# EAGLE design L240-1 (EAGLE 9.5.0)
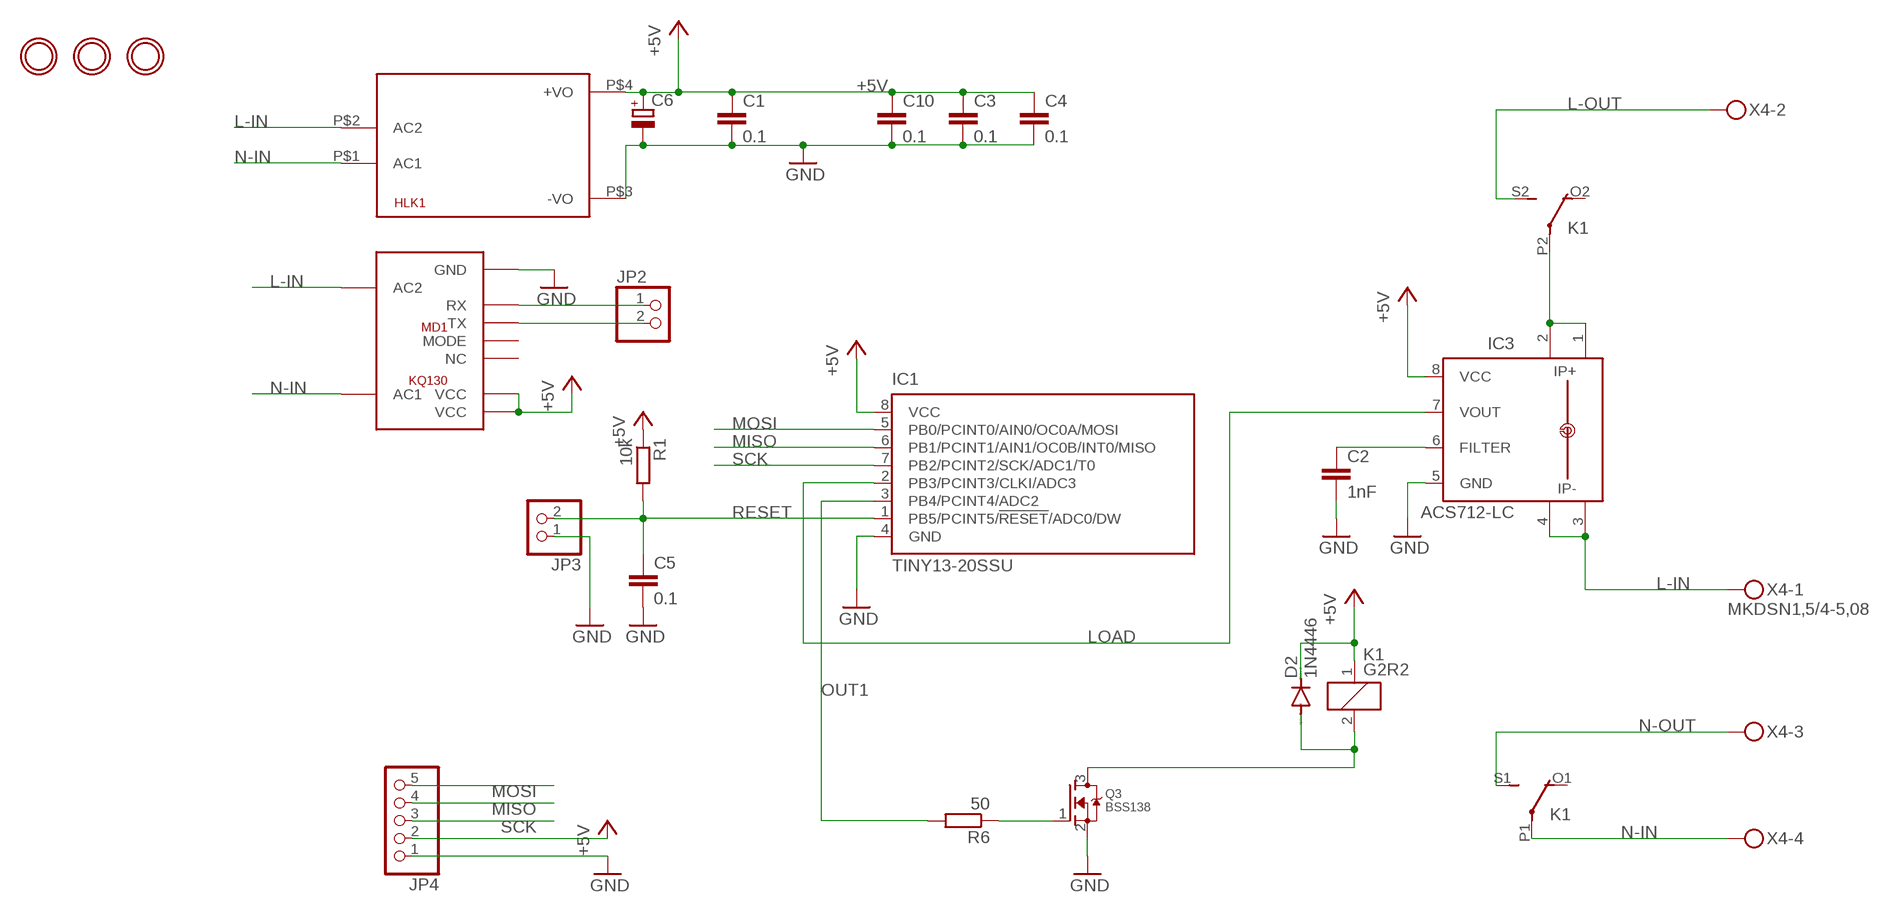
[diagram p0: schematic, sheet 1]

## Parts
C1  0.1  C-EUC0805  [C0805]
C2  1nF  C-EUC0805  [C0805]
C3  0.1  C-EUC0805  [C0805]
C4  0.1  C-EUC0805  [C0805]
C5  0.1  C-EUC0805  [C0805]
C6  CPOL-EUE5-5  [E5-5]
C10  0.1  C-EUC0805  [C0805]
D2  1N4446  [DO35-10]
HLK1  HLK-PM013W  [HLK-PM01]
IC1  TINY13-20SSU  [8S1]
IC3  ACS712-LC  [SOIC8]
JP2  PINHD-1X2  [1X02]
JP3  PINHD-1X2  [1X02]
JP4  PINHD-1X5  [1X05]
K1  G2R2  [G2R2]
MD1  KQ130  [KQ130]
Q3  BSS138  MOSFET-NWIDE  [SOT23-WIDE]
R1  10k  R-EU_R0805  [R0805]
R6  50  R-EU_R0805  [R0805]
U$1  MOUNTINGHOLE3.0THIN  [MOUNTINGHOLE_3.0_PLATEDTHIN]
U$2  MOUNTINGHOLE3.0THIN  [MOUNTINGHOLE_3.0_PLATEDTHIN]
U$3  MOUNTINGHOLE3.0THIN  [MOUNTINGHOLE_3.0_PLATEDTHIN]
X4  MKDSN1,5/4-5,08  [MKDSN1,5/4-5,08]

## Nets
+5V: C1.1 C3.1 C4.1 C6.+ C10.1 D2.C HLK1.P$4(+VO) IC1.8(VCC) IC3.8(VCC) JP4.2 K1.1 MD1.VCC@1(VCC) MD1.VCC@2(VCC) R1.1
GND: C1.2 C2.2 C3.2 C4.2 C5.2 C6.- C10.2 HLK1.P$3(-VO) IC1.4(GND) IC3.5(GND) JP3.1 JP4.1 MD1.GND Q3.2(S)
L-IN: HLK1.P$2(AC2) IC3.3(IP-) IC3.4(IP-1) MD1.AC2 X4.1
L-OUT: K1.S2(3:S) X4.2
LOAD: IC1.2(PB3/PCINT3/CLKI/ADC3) IC3.7(VOUT)
MISO: IC1.6(PB1/PCINT1/AIN1/OC0B/INT0/MISO) JP4.4
MOSI: IC1.5(PB0/PCINT0/AIN0/OC0A/MOSI) JP4.5
N$1: JP2.1 MD1.RX
N$2: IC3.1(IP+) IC3.2(IP+1) K1.P2(3:P)
N$3: JP2.2 MD1.TX
N$7: C2.1 IC3.6(FILTER)
N$11: Q3.1(G) R6.1
N$13: D2.A K1.2 Q3.3(D)
N-IN: HLK1.P$1(AC1) K1.P1(2:P) MD1.AC1 X4.4
N-OUT: K1.S1(2:S) X4.3
OUT1: IC1.3(PB4/PCINT4/ADC2) R6.2
RESET: C5.1 IC1.1(PB5/PCINT5/!RESET!/ADC0/DW) JP3.2 R1.2
SCK: IC1.7(PB2/PCINT2/SCK/ADC1/T0) JP4.3
Unconnected: K1.O1(2:O) K1.O2(3:O) MD1.MODE MD1.NC

## Library data of the parts
C1-C5 C10 = rcl:C-EU: CAPACITOR, European symbol
C6 = rcl:CPOL-EU: POLARIZED CAPACITOR, European symbol; SPICEPREFIX: C
D2 = diode:1N4446: DIODE high speed (Philips)
HLK1 = hi-link:HLK-PM01: Hi-Link Power Supply HLK-PM01 3W Author: Ahmed Said <https://github.com/AhmedSaid/EAGLELibraries>
IC1 = atmel:TINY13: 8-bit AVR Microcontroller with 1K Bytes In-System Programmable Flash Source: http://www.atmel.com/dyn/resources/prod_documents/2535S.pdf; MPN: ATTINY13-20SSU; OC_FARNELL: 1455133; OC_NEWARK: 58M3771
IC3 = allegro-2:ACS712-LC
JP2 JP3 = pinhead:PINHD-1X2: PIN HEADER
JP4 = pinhead:PINHD-1X5: PIN HEADER
K1 = relay:G2R2: RELAY 2 x switch, Omron; MF: OMRON COMPONENTS USA; MPN: G2R-2-DC6; OC_FARNELL: unknown; OC_NEWARK: 89C5317
MD1 = MyLib:KQ130
Q3 = MyLib:MOSFET-N: N-Channel Mosfet LEGEND VDS: Voltage Drain-Source ID: Drain Current RDS(ON): Drain-Source On-State Resistance VGS(TH): Gate-Source Threshold Voltage CISS: Drain-Source Input Capacitance SOT-23 Name VDS ID RDS(ON) VGS(TH) CISS Order Number 2N7002E 60V 260mA 2.5 Ohm 2.5V @ 250uA 26.7pF @ 25V 2N7002ET1GOSTR-ND BSH103 30V 850mA 400 mOhm 400mV @ 1mA 83pF @ 24V BSH103,235-ND BSS138 60V 320mA 1.6 Ohm 1.5V @ 250uA 50pF @ 10V Mouser: 771-BSS138PW115 DMN2075U-7 20V 4.2A 38 mOhm 1V @ 250 uA 594.3pF @ 10V DMN2075U-7DICT-ND IRLML6344TRPbF 30V 5.0A 37 mOhm * BSS138 good choice for I2C level-shifting
R1 R6 = rcl:R-EU_: RESISTOR, European symbol
U$1-U$3 = MyLib:MOUNTINGHOLE: Mounting Hole For #2 screws (0.086"/2.18mm width, 0.094"/2.4mm hole) use 2.5mm
X4 = con-phoenix-508:MKDSN1,5/4-5,08: MKDSN 1,5/ 4-5,08 Printklemme Nennstrom: 13,5 A Nennspannung: 250 V Rastermaß: 5,08 mm Polzahl: 4 Anschlussart: Schraubanschluss Montage: Löten Anschlussrichtung Leiter/Platine: 0 ° Artikelnummer: 1729144 Source: http://eshop.phoenixcontact.com .. 1729144.pdf

## Board
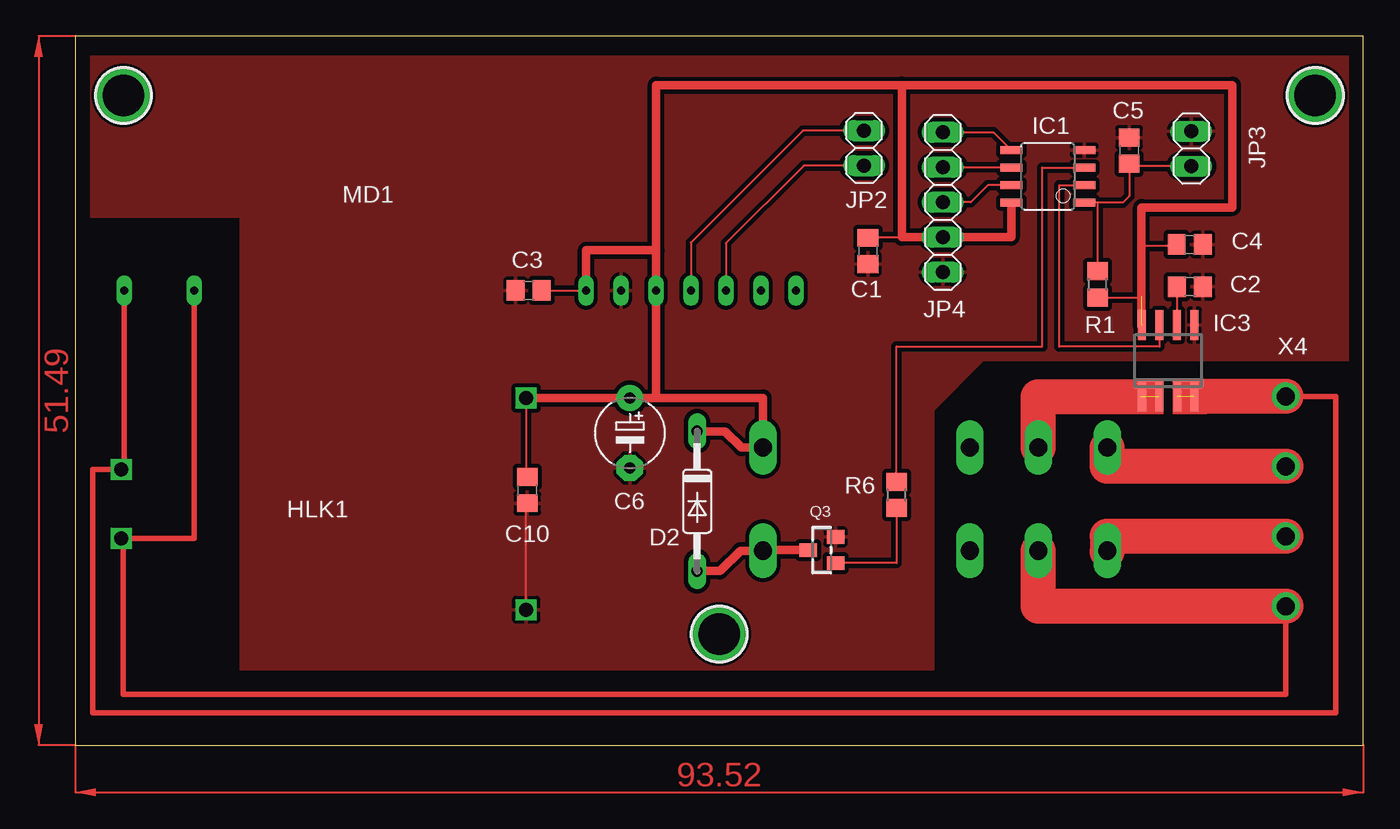
[diagram p1: board, top side]
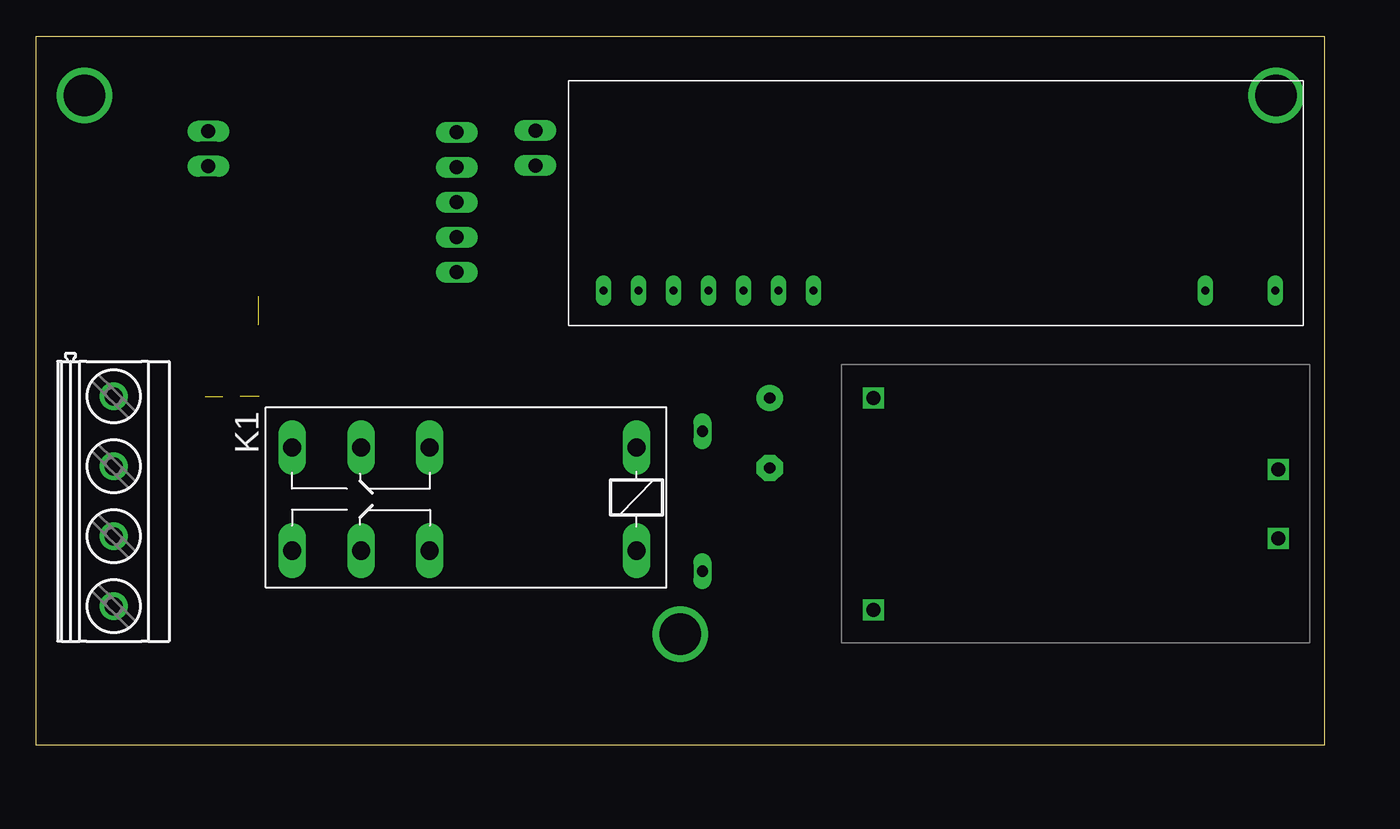
[diagram p2: board, bottom side, seen from below]

Size 93.52 x 51.49 mm. Coordinates in mm from the lower left corner, seen from the top.
Outline: 0,0 93.52,0 93.52,51.49 0,51.49 0,0
Copper layers (1*16): Top 0.035mm / dielectric 1.5mm / Bottom 0.035mm
Design rules "default *": minimum track width 6mil, minimum drill 0.35mm, track to track 12mil, track to pad 12mil, pad to pad 12mil, via to via 12mil, smd to smd 8mil, copper to edge 40mil, drill to drill 6mil, minimum pad ring 10mil, minimum via ring 8mil, stop-mask expansion 4mil, vias tented up to drill 0mil, thermal gap 10mil

### Footprints (pad centres in the part's own frame; a part is rotated, then mirrored left to right if it is on the bottom)
C0805 = smd 1.3 x 1.5: 1 -0.95,0; 2 0.95,0
E5-5 = drill 0.813 pad 1.905: + -2.54,0 | drill 0.813 pad 1.905 octagon: - 2.54,0
DO35-10 = drill 0.813 long: A 5.08,0; C -5.08,0
HLK-PM01 = drill 1.016 square: P$1 -14.7,2.5; P$2 -14.7,-2.5; P$3 14.7,7.7; P$4 14.7,-7.7
8S1 = smd 0.6 x 1.6: 1 -1.905,-2.654; 2 -0.645,-2.654; 3 0.625,-2.654; 4 1.895,-2.654; 5 1.905,2.654; 6 0.635,2.654; 7 -0.635,2.654; 8 -1.905,2.654
SOIC8 = smd 0.6 x 2.2: 1 -1.905,-2.6; 2 -0.635,-2.6; 3 0.635,-2.6; 4 1.905,-2.6; 5 1.905,2.6; 6 0.635,2.6; 7 -0.635,2.6; 8 -1.905,2.6
1X02 = drill 1.016 long: 1 -1.27,0; 2 1.27,0
1X05 = drill 1.016 long: 1 -5.08,0; 2 -2.54,0; 3 0,0; 4 2.54,0; 5 5.08,0
G2R2 = drill 1.321 long: 1 -2.54,-3.683; 2 -2.54,3.81; O1 12.471,3.81; O2 12.471,-3.683; P1 17.45,3.81; P2 17.45,-3.683; S1 22.454,3.81; S2 22.454,-3.683
KQ130 = drill 0.6 long: AC1 -13.208,0; AC2 -18.288,0; GND 17.78,0; MODE 27.94,0; NC 30.48,0; RX 22.86,0; TX 25.4,0; VCC@1 20.32,0; VCC@2 15.24,0
SOT23-WIDE = smd 1 x 1.27: 1 -0.95,-1; 2 0.95,-1; 3 0,1
R0805 = smd 1.3 x 1.5: 1 -0.95,0; 2 0.95,0
MOUNTINGHOLE_3.0_PLATEDTHIN = drill 3 pad 3.6: P$1 0,0
MKDSN1,5/4-5,08 = drill 1.3 pad 2: 1 -7.641,0.025; 2 -2.561,0.025; 3 2.519,0.025; 4 7.599,0.025

### Placement (x,y rotation side)
C1  57.55,35.89 270 top
C2  80.92,33.29 0 top
C3  32.92,33.02 180 top
C4  80.91,36.36 0 top
C5  76.52,43.18 90 top
C6  40.26,22.67 270 top
C10  32.81,18.52 270 top
D2  45.15,17.72 270 top
HLK1  18.03,17.53 180 bottom
IC1  70.61,41.31 90 top
IC3  79.34,27.91 0 top
JP2  57.28,43.37 270 top
JP3  81.03,43.31 270 top
JP4  62.99,39.43 90 top
K1  52.47,17.93 180 bottom
MD1  21.84,33.02 180 bottom
Q3  54.2,14.17 90 top
R1  74.23,33.46 90 top
R6  59.64,18.16 90 top
U$1  3.49,47.18 0 top
U$2  90.02,47.18 0 top
U$3  46.76,8.06 0 top
X4  87.92,17.68 270 bottom

### Tracks (layer width: path | path; a pad name or v marks a point on that pad's centre or on a via)
+5V  (2 unrouted)
  Top 0.152: MD1.VCC@2 | HLK1.P$4 32.73,19.55 C10.1 | C3.1 MD1.VCC@2 | 77.41,30.55 77.41,30.42 | C1.1 57.57,36.89 60.01,36.89 | C4.1 79.86,36.26 77.41,36.26 | R1.1 77.41,32.51
  Top 0.61: 42.16,25.23 49.93,25.23 K1.1 48.36,21.61 47.18,22.8 D2.C | 42.16,25.23 MD1.VCC@1 42.16,35.94 | MD1.VCC@2 37.08,35.94 42.16,35.94 | 60.01,47.94 42.16,47.94 42.16,35.94 | 60.01,47.94 60.01,36.89 JP4.2 67.95,36.89 IC1.8 | 77.41,30.42 77.41,32.51 | 77.41,32.58 77.41,36.26 77.41,39.05 84.01,39.05 84.01,47.94 60.01,47.94 | HLK1.P$4 32.75,25.21 C6.+ 42.15,25.21 42.16,25.23
GND
  Top 0.152: C10.2 32.73,17.49 HLK1.P$3
  pour Top: 0.83,50.04 92.65,50.04 92.65,27.94 65.91,27.94 62.29,24.32 62.29,5.46 12,5.46 12,38.35 0.83,38.35
L-IN  (1 unrouted)
  Top 0.152: HLK1.P$2 3.56,20.03 | 3.43,33.02 MD1.AC2 | X4.1
  Top 0.406: MD1.AC2 3.56,20.03 | X4.1 91.5,25.32 91.5,2.36 1.28,2.36 1.28,20.03 HLK1.P$2
  Top 2.54: X4.1 81.26,25.32 IC3.4
L-OUT
  Top 2.54: X4.2 74.93,20.24 K1.S2
LOAD
  Top 0.152: IC3.7 78.71,28.93 71.44,28.93 71.44,40.66 IC1.2
MISO
  Top 0.152: IC1.6 67.92,41.97 JP4.4
MOSI
  Top 0.152: IC1.5 66.65,44.51 JP4.5
N$1
  Top 0.152: JP2.1 52.83,44.64 44.7,36.51 MD1.RX
N$2  (2 unrouted)
  Top 2.54: K1.P2 69.92,25.31 77.34,25.31
N$3
  Top 0.152: JP2.2 52.9,42.1 47.24,36.45 MD1.TX
N$7
  Top 0.152: IC3.6 79.95,30.55 79.97,30.55 C2.1
N$11
  Top 0.152: R6.1 59.64,13.22 Q3.1
N$13
  Top 0.152: K1.2 49.93,14.17
  Top 0.61: 49.93,14.17 Q3.3 | K1.2 48.28,14.12 46.8,12.64 D2.A
N-IN
  Top 0.152: 3.49,15.03 HLK1.P$1
  Top 0.406: MD1.AC1 8.64,15.03 3.49,15.03 3.49,3.68 87.89,3.68 X4.4
  Top 2.54: X4.4 69.92,10.08 K1.P1
N-OUT
  Top 0.152: 74.93,14.03 K1.S1
  Top 2.54: X4.3 74.93,15.16 74.93,14.03
OUT1
  Top 0.152: IC1.3 73.26,41.94 70.2,41.94 70.2,28.96 59.64,28.96 R6.2
RESET
  Top 0.152: JP3.2 76.52,42.04 C5.1 76.52,39.88 76.04,39.4 74.23,39.4 | R1.2 74.23,39.4 | 74.23,39.4 IC1.1
SCK
  Top 0.152: IC1.7 66.26,40.67 65.02,39.43 JP4.3
(copper drawn outside any net)
  shapes: Top area x4